# Altium schematic sheet sensors_power.SchDoc: SENSORS POWER & COMM
size A3; CheckedBy: rrodrigu; Author: Satxo; CompanyName: Satxo; Revision: 0v2; SheetNumber: 1; SheetTotal: 1; ProjectName: SENSORS_POWER
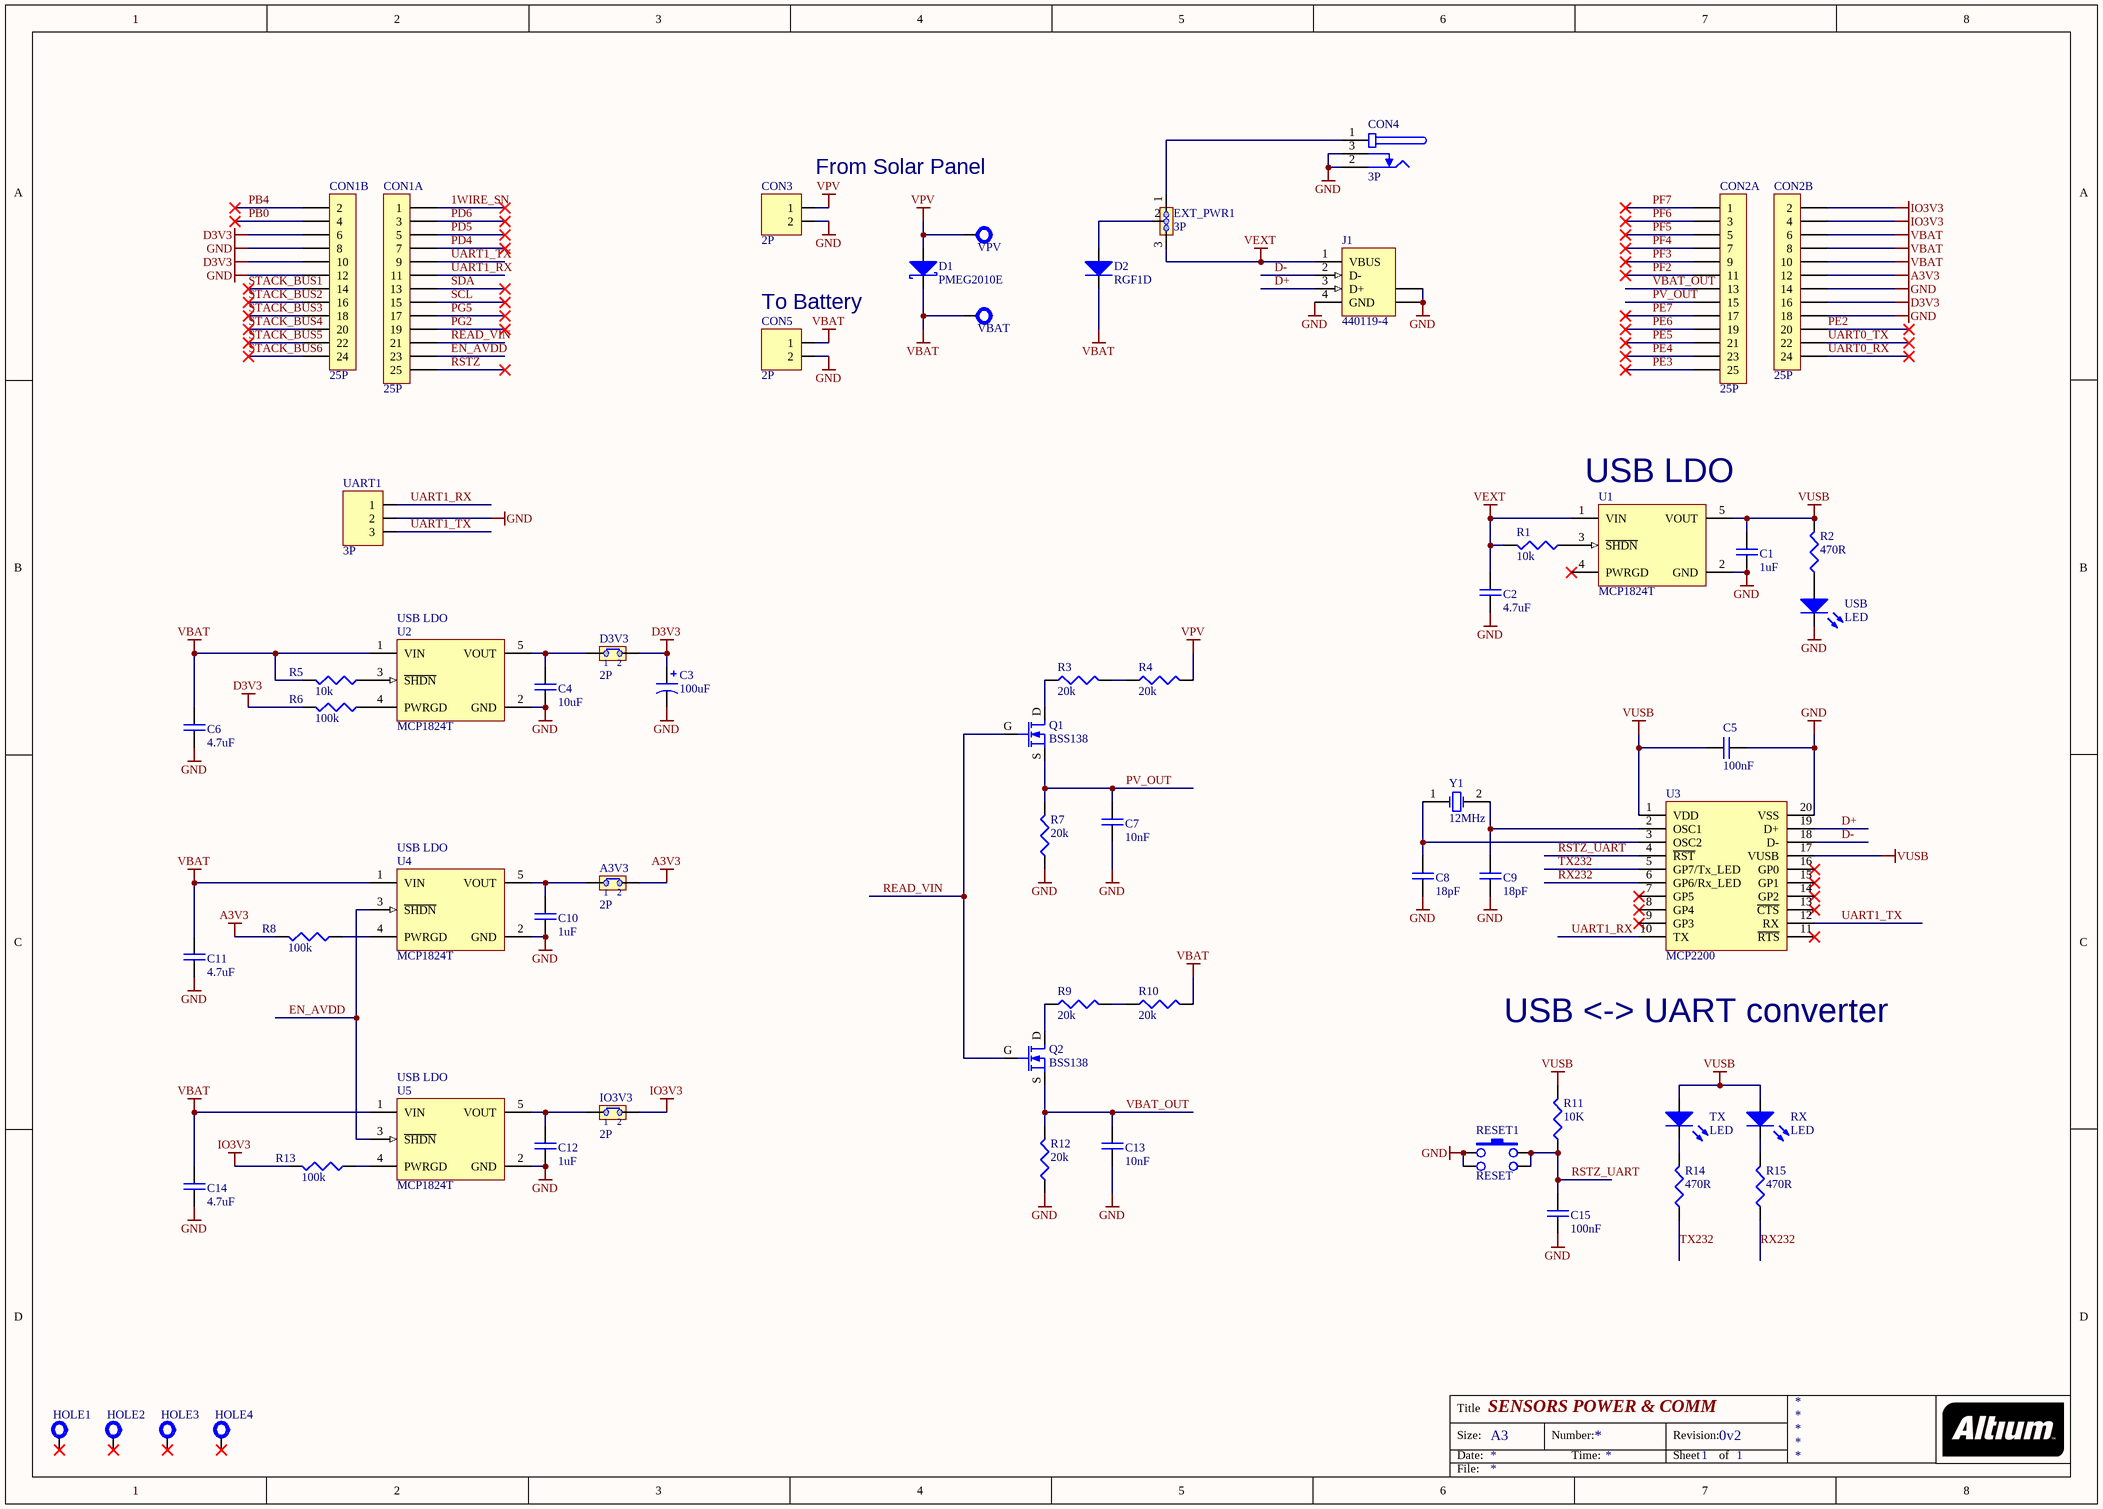
[diagram p0: sensors_power.SchDoc]

## Parts
A3V3  2P  [SIP-2]
C1  1uF  [0805]
C2  4.7uF  [0805]
C3  100uF  [RADIAL-2.5MM]
C4  10uF  [0805]
C5  100nF  [0603]
C6  4.7uF  [0805]
C7  10nF  [0603]
C8  18pF  [0603]
C9  18pF  [0603]
C10  1uF  [0805]
C11  4.7uF  [0805]
C12  1uF  [0805]
C13  10nF  [0603]
C14  4.7uF  [0805]
C15  100nF  [0603]
CON1  25P  [DF9-25]  (parts A,B of 2)
CON2  25P  [DF9-25]  (parts A,B of 2)
CON3  2P  [JST-2MM]
CON4  3P  [JACKPOW/PD-2.5MM-TH]
CON5  2P  [INTERLOCK2-5MM]
D1  PMEG2010E  [SOD-123]
D2  RGF1D  [DO-214BA]
D3V3  2P  [SIP-2]
EXT_PWR1  3P  [SIP-3]
HOLE1  HOLE  [NPTH-3MM]  (value not drawn)  (no BOM)
HOLE2  HOLE  [NPTH-3MM]  (value not drawn)  (no BOM)
HOLE3  HOLE  [NPTH-3MM]  (value not drawn)  (no BOM)
HOLE4  HOLE  [NPTH-3MM]  (value not drawn)  (no BOM)
IO3V3  2P  [SIP-2]
J1  440119-4  [440119]
Q1  BSS138  [SOT-23@GSD]
Q2  BSS138  [SOT-23@GSD]
R1  10k  [0603]
R2  470R  [0603]
R3  20k  [0603]
R4  20k  [0603]
R5  10k  [0603]
R6  100k  [0603]
R7  20k  [0603]
R8  100k  [0603]
R9  20k  [0603]
R10  20k  [0603]
R11  10K  [0603]
R12  20k  [0603]
R13  100k  [0603]
R14  470R  [0603]
R15  470R  [0603]
RESET1  RESET  [MICROSWITCH]
RX  LED  [0805@DIODE]
TX  LED  [0805@DIODE]
U1  MCP1824T  [SOT-23-5]
U2  MCP1824T  [SOT-23-5]
U3  MCP2200  [SOIC-20]
U4  MCP1824T  [SOT-23-5]
U5  MCP1824T  [SOT-23-5]
UART1  3P  [SIP-3]
USB  LED  [0805@DIODE]
VBAT  Test Point  [TERMINAL]  (value not drawn)  (no BOM)
VPV  Test Point  [TERMINAL]  (value not drawn)  (no BOM)
Y1  12MHz  [CSM-7]

## Nets
A3V3: A3V3.2 CON2.12 R8.2
D3V3: C3.1(P) CON1.6 CON1.10 CON2.16 D3V3.2 R6.2
GND: C1.1 C2.1 C3.2(N) C4.1 C5.1 C6.1 C7.1 C8.1 C9.1 C10.1 C11.1 C12.1 C13.1 C14.1 C15.1 CON1.8 CON1.12 CON2.14 CON2.18 CON3.2 CON4.2 CON4.3 CON5.2 J1.4(GND) J1.5(SHLD) J1.6(SHLD) R7.1 R12.1 RESET1.1 RESET1.3 U1.2(GND) U2.2(GND) U3.20(VSS) U4.2(GND) U5.2(GND) UART1.2 USB.K
IO3V3: CON2.2 CON2.4 IO3V3.2 R13.2
VBAT: C6.2 C11.2 C14.2 CON2.6 CON2.8 CON2.10 CON5.1 D1.K D2.K R5.2 R10.2 U2.1(VIN) U4.1(VIN) U5.1(VIN) VBAT.1(TP)
VEXT: C2.2 EXT_PWR1.3 J1.1(VBUS) R1.2 U1.1(VIN)
VPV: CON3.1 D1.A R4.2 VPV.1(TP)
VUSB: C1.2 C5.2 R2.2 R11.2 RX.A TX.A U1.5(VOUT) U3.1(VDD) U3.17(VUSB)
1WIRE_SN: CON1.1
D+: J1.3(D+) U3.19(D+)
D-: J1.2(D-) U3.18(D-)
EN_AVDD: CON1.23 U4.3(~{SHDN}) U5.3(~{SHDN})
PB0: CON1.4
PB4: CON1.2
PD4: CON1.7
PD5: CON1.5
PD6: CON1.3
PE2: CON2.20
PE3: CON2.25
PE4: CON2.23
PE5: CON2.21
PE6: CON2.19
PE7: CON2.17
PF2: CON2.11
PF3: CON2.9
PF4: CON2.7
PF5: CON2.5
PF6: CON2.3
PF7: CON2.1
PG2: CON1.19
PG5: CON1.17
PV_OUT: C7.2 CON2.15 Q1.S R7.2
READ_VIN: CON1.21 Q1.G Q2.G
RSTZ: CON1.25
RSTZ_UART: C15.2 R11.1 RESET1.2 RESET1.4 U3.4(~{RST})
RX232: R15.1 U3.6(GP6/Rx_LED)
SCL: CON1.15
SDA: CON1.13
STACK_BUS1: CON1.14
STACK_BUS2: CON1.16
STACK_BUS3: CON1.18
STACK_BUS4: CON1.20
STACK_BUS5: CON1.22
STACK_BUS6: CON1.24
TX232: R14.1 U3.5(GP7/Tx_LED)
UART0_RX: CON2.24
UART0_TX: CON2.22
UART1_RX: CON1.11 U3.10(TX) UART1.1
UART1_TX: CON1.9 U3.12(RX) UART1.3
VBAT_OUT: C13.2 CON2.13 Q2.S R12.2
NetA3V3_1: A3V3.1 C10.2 U4.5(VOUT)
NetC4_2: C4.2 D3V3.1 U2.5(VOUT)
NetC8_2: C8.2 U3.3(OSC2) Y1.1(OSC1)
NetC9_2: C9.2 U3.2(OSC1) Y1.2(OSC2)
NetC12_2: C12.2 IO3V3.1 U5.5(VOUT)
NetCON4_1: CON4.1 EXT_PWR1.1
NetD2_A: D2.A EXT_PWR1.2
NetQ1_D: Q1.D R3.1
NetQ2_D: Q2.D R9.1
NetR1_1: R1.1 U1.3(~{SHDN})
NetR2_1: R2.1 USB.A
NetR3_2: R3.2 R4.1
NetR5_1: R5.1 U2.3(~{SHDN})
NetR6_1: R6.1 U2.4(PWRGD)
NetR8_1: R8.1 U4.4(PWRGD)
NetR9_2: R9.2 R10.1
NetR13_1: R13.1 U5.4(PWRGD)
NetR14_2: R14.2 TX.K
NetR15_2: R15.2 RX.K

Not connected (* = marked no-connect by the designer): HOLE1 1(TP)*; HOLE2 1(TP)*; HOLE3 1(TP)*; HOLE4 1(TP)*; U1 4(PWRGD)*; U3 7(GP5)* 8(GP4)* 9(GP3)* 11(~{RTS})* 13(~{CTS})* 14(GP2)* 15(GP1)* 16(GP0)*

## Notes on the sheet
- (near CON3) From Solar Panel
- (near CON5) To Battery
- (near U1) USB LDO
- (near U2) USB LDO
- (near U4) USB LDO
- USB <-> UART converter
- (near U5) USB LDO
- Title
- Size:
- Date:
- A3
- Number:
- Time:
- Revision:
- Sheet
- of
- File:

## Library data of the parts
A3V3 IO3V3 = JMP2: 2-pin Jumper; Owner: Nuno Brum; Sub-Type: Connector; STATE1: 1; Assembly: INS; Validation Date: 2006-05-15; Creation Date: 2002-07-17; Status: Valid; Type: Electrical & Mechanical
C1 C2 C4-C15 = CAP: Capacitor; Owner: Nuno Brum; Sub-Type: Ceramic; Assembly: INS; Maximum Voltage: *; Creation Date: 2005-04-28; Status: Valid; Validation date: 2006-05-15; Type: Capacitor
C3 = CAP POL: Polarized Capacitor; Owner: Nuno Brum; Sub-Type: Tantalum; Assembly: INS; Validation date: 2006-05-15; Creation Date: 2005-04-28; Status: Valid; Type: Capacitor
CON1 CON2 = CON25: Connector 25 Pins; Owner: Ricardo Rodrigues; Assembly: INS; Sub-Type: Connector; Creation Date: 2013-01-13; Status: Valid; Validation Date: 2012-01-13; Type: Electrical & Mechanical
CON3 CON5 = CON02: Connector 2 pins; Owner: Rui Rebelo; Assembly: INS; Sub-Type: Connector; Creation Date: 2005-05-27; Status: Valid; Validation Date: 2006-05-15; Type: Electrical & Mechanical
CON4 = JACK POWER PD: Jack Power with insertion detect; Sub-Type: Connector; Owner: Gonçalo Costa; Assembly: INS; Creation Date: 2005-12-05; Status: New; Type: Electrical & Mechanical
D1 = Diode Schottky: Small Signal Schottky Diode; Owner: Nuno Brum; Assembly: INS; Validation date: 2006-05-15; Creation Date: 2001-06-05; Sub-Type: Schottky; Status: Valid; Model: PMEG2010E; Type: Diode
D2 = Diode: Vishay Standard Avalanche Sinterglass Diode; Owner: Nuno Brum; Sub-Type: Generic; Assembly: INS; Validation date: 2006-05-15; Creation Date: 2001-06-05; Status: Valid; Model: RGF1D; Type: Diode
D3V3 = JMP2: 2-pin Jumper; Owner: Nuno Brum; Sub-Type: Connector; STATE1: 1; Type: Electrical & Mechanical; Assembly: INS; Validation Date: 2006-05-15; Creation Date: 2002-07-17; Status: Valid
EXT_PWR1 = JMP3: 3-Jumper; Owner: Nuno Brum; Sub-Type: Connector; STATE1: 0; Assembly: INS; Validation Date: 2006-05-15; Creation Date: 2002-07-17; Status: Valid; Type: Electrical & Mechanical
HOLE1-HOLE4 = PCB HOLE: PCB Fixation Hole M3; Owner: Nuno Brum; Sub-Type: Mechanical; Type: PCB; Creation Date: 2005-06-01; Status: Valid; Validation Date: 2006-05-15; Assembly: PCB
J1 = 440119-4: USB 1.1, Right Angle, Thru-Hole, B Type, Receptacle, 4 Position, Black; ContactMaterial: Copper Alloy; ContactPlating: Gold (5) over Nickel; TerminationLength: 2.84mm [0.112in.]; PCB_Layout: Complies with manufacturer's recommendation.; DrillSize: Corresponds to nominal value.; PanelGround: Without; Published: 15-Jul-2004; DatasheetDocument: 12-Jan-2004; PackageDocument: 12-Jan-2004; PackageReference: 440119; Publisher: Altium Limited; HousingMaterial: Thermoplastic; ComponentLink1Description: Manufacturer Link; ComponentLink1URL: http://www.tycoelectronics.com/; ComponentLink2Description: Packaging Specification; ComponentLink2URL: http://ecommas.tycoelectronics.com/commerce/DocumentDelivery/DDEController?Action=showdoc&DocId=Customer+Drawing%7F440119%7FC%7Ftif%7FEnglish%7FC_440119_C.tif
Q1 Q2 = MOSFET-N: N-Channel Logic Level Enhancement Mode Field Effect Transistor; pin to pad: 2>3 3>2; Owner: Nuno Brum; Sub-Type: MOSFET; Assembly: INS; Creation Date: 2001-06-05; Status: Valid; Model: BSS138; Type: Transistor
R1-R15 = RES: Resistor; Owner: Nuno Brum; Sub-Type: Generic; Assembly: INS; Validation date: 2006-05-15; Creation Date: 2002-07-17; Status: Valid; Power: *; Type: Resistor
RESET1 = SW1: Switch Push Button; Owner: Nuno Brum; Assembly: INS; Validation Date: 2006-05-15; Sub-Type: Switch; Creation Date: 2002-07-17; Status: Valid; Type: Electrical & Mechanical
RX TX USB = LED: Light emitting diode; Owner: Nuno Brum; Assembly: INS; Creation Date: 2001-06-05; Sub-Type: LED; Status: Valid; Validation date: 2006-05-15; Model: LED; Type: Diode
U1 U2 U4 U5 = MCP1824T: 300 mA, Low Voltage, Low Quiescent Current LDO Regulator, 5-Pin SOT-23, Extended Temperature, Tape and Reel; Published: 29-Jan-2009; DatasheetVersion: revA, Aug-2007; PackageVersion: revBB, Aug-2009; PackageReference: SOT-23-OT5; Publisher: Altium Limited; PackageDescription: 5-Lead Plastic Small Outline Transistor (OT) [SOT-23]; Supplier 1: Digi-Key; Supplier Part Number 1: MCP1824T-3302E/OTTR-ND; Supplier 2: Digi-Key; Supplier Part Number 2: MCP1824T-3302E/OTCT-ND; Supplier 3: Digi-Key; Supplier Part Number 3: MCP1824T-3302E/OTDKR-ND; Supplier 4: Farnell; Supplier Part Number 4: 1578387; Code_IPC: SOT23-5; ComponentLink1Description: Datasheet; ComponentLink1URL: http://ww1.microchip.com/downloads/en/DeviceDoc/22070a.pdf; ComponentLink2Description: Packaging Specification; ComponentLink2URL: http://www.microchip.com/stellent/groups/techpub_sg/documents/packagingspec/en012702.pdf; ComponentLink3Description: Microchip.com Home; ComponentLink3URL: http://www.microchip.com/
U3 = MCP2200: USB to Serial interface; Published: 29-Jan-2009; DatasheetVersion: revE, Aug-2007; PackageVersion: revBB, Aug-2009; PackageReference: SSOP-SS20; Publisher: Altium Limited; PackageDescription: 20-Lead Plastic Shrink Small Outline (SS) - 5.3mm Body [SSOP]; Supplier 1: Digi-Key; Supplier Part Number 1: MCP23008T-E/SS-ND; Code_JEDEC: MO-150; Code_IPC: SOP65P780-20; ComponentLink1Description: Datasheet; ComponentLink1URL: http://ww1.microchip.com/downloads/en/DeviceDoc/21919e.pdf; ComponentLink2Description: Packaging Specification; ComponentLink2URL: http://www.microchip.com/stellent/groups/techpub_sg/documents/packagingspec/en012702.pdf; ComponentLink3Description: Microchip.com Home; ComponentLink3URL: http://www.microchip.com/
UART1 = CON03: Connector 3 pins; Owner: Rui Rebelo; Assembly: INS; Sub-Type: Connector; Creation Date: 2005-05-27; Status: Valid; Validation Date: 2006-05-15; Type: Electrical & Mechanical
VBAT VPV = TEST-PROBE: Test/Probe Point; Owner: Nuno Brum; Sub-Type: Mechanical; Assembly: PCB; Validation Date: 2006-05-15; Type: PCB; Creation Date: 2005-06-01; Status: Valid
Y1 = Crystal Oscillator: Published: 17-Jul-2002; DatasheetDocument: 18-Apr-2000; PackageReference: CSM-7; Publisher: Altium Limited; ComponentLink1Description: Manufacturer Link; ComponentLink1URL: http://www.ecsxtal.com/; ComponentLink2Description: Datasheet; ComponentLink2URL: http://www.ecsxtal.com/pdf3/CSM_7.pdf